# EAGLE design lin_usb_probe (EAGLE 6.5.0)
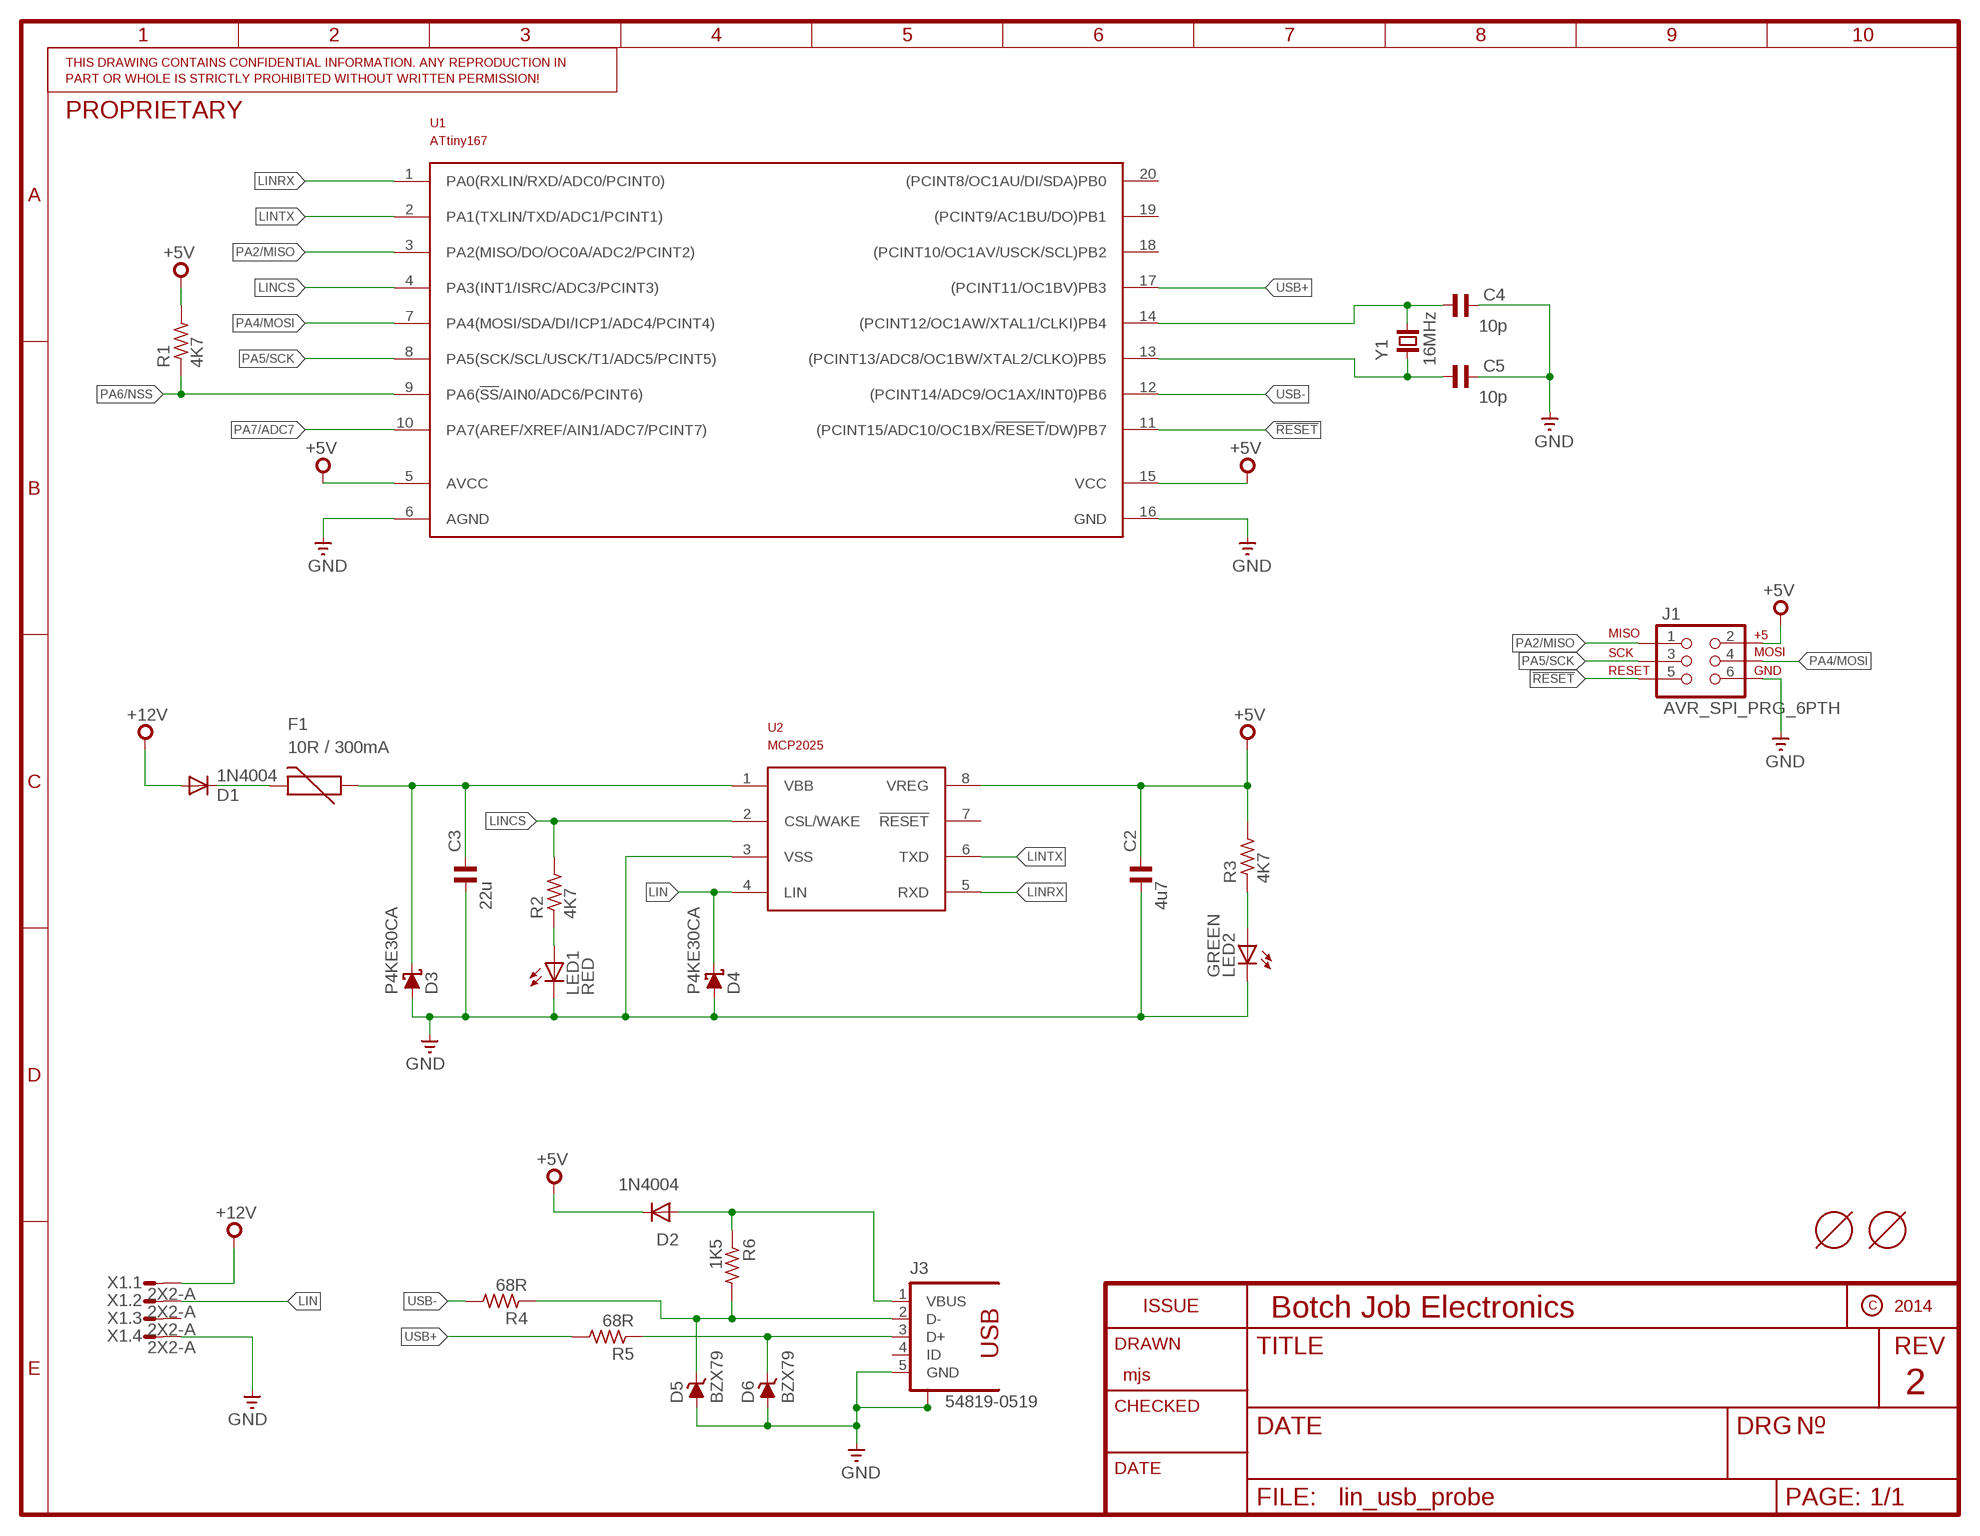
[diagram p0: schematic, sheet 1]
FRAME1 (US_8,5X11): COMPANY: Botch Job Electronics; DRAWN: mjs; REV: 2

## Parts
C2  4u7  C-EU050-024X044  [C050-024X044]
C3  22u  C-EU050-024X044  [C050-024X044]
C4  10p  C-EU025-024X044  [C025-024X044]
C5  10p  C-EU025-024X044  [C025-024X044]
D1  1N4004  [DO41-10]
D2  1N4004  [DO41-10]
D3  P4KE30CA  SCHOTTKY-DIODEDO41-10  [DO41-10]
D4  P4KE30CA  SCHOTTKY-DIODEDO41-10  [DO41-10]
D5  BZX79  [DO35Z10]
D6  BZX79  [DO35Z10]
F1  10R / 300mA  PTCPTH  [PTC]
J1  AVR_SPI_PRG_6PTH  [2X3]
J3  54819-0519  [54819-0519]
LED1  RED  LED3MM  [LED3MM]
LED2  GREEN  LED3MM  [LED3MM]
R1  4K7  R-EU_0207/10  [0207/10]
R2  4K7  R-EU_0207/10  [0207/10]
R3  4K7  R-EU_0207/10  [0207/10]
R4  68R  R-EU_0207/10  [0207/10]
R5  68R  R-EU_0207/10  [0207/10]
R6  1K5  R-EU_0207/10  [0207/10]
U1  ATtiny167  ATTINY16720X  [TSSOP20]
U2  MCP2025  [SO08]
U$1  MOUNT-HOLE3.1MM  [MOUNT-HOLE3.1]
U$2  MOUNT-HOLE3.1MM  [MOUNT-HOLE3.1]
X1  2X2-A  [3-794618-4]
Y1  16MHz  CRYTALHC49S  [HC49/S]

## Nets
!RESET: J1.5 U1.11((PCINT15/ADC10/OC1BX/!RESET!/DW)PB7)
+5V [power]: C2.1 D2.C J1.2 R1.2 R3.2 U1.5(AVCC) U1.15(VCC) U2.8(VREG)
+12V [power]: D1.A X1.1
GND [power]: C2.2 C3.2 C4.1 C5.1 D3.A D4.A D5.A D6.A J1.6 J3.5(GND) J3.S1 J3.S2 LED1.K(C) LED2.K(C) U1.6(AGND) U1.16(GND) U2.3(VSS) X1.4
LIN: D4.C U2.4(LIN) X1.2
LINCS: R2.2 U1.4(PA3(INT1/ISRC/ADC3/PCINT3)) U2.2(CSL/WAKE)
LINRX: U1.1(PA0(RXLIN/RXD/ADC0/PCINT0)) U2.5(RXD)
LINTX: U1.2(PA1(TXLIN/TXD/ADC1/PCINT1)) U2.6(TXD)
N$1: C4.2 U1.14((PCINT12/OC1AW/XTAL1/CLKI)PB4) Y1.2
N$2 [power]: C3.1 D3.C F1.P$1 U2.1(VBB)
N$3: LED1.A R2.1
N$4: LED2.A R3.1
N$5 [power]: D1.C F1.P$2
N$6: D6.C J3.3(D+) R5.1
N$7: D5.C J3.2(D-) R4.1 R6.2
N$8 [power]: D2.A J3.1(VBUS) R6.1
N$9: C5.2 U1.13((PCINT13/ADC8/OC1BW/XTAL2/CLKO)PB5) Y1.1
PA2/MISO: J1.1 U1.3(PA2(MISO/DO/OC0A/ADC2/PCINT2))
PA4/MOSI: J1.4 U1.7(PA4(MOSI/SDA/DI/ICP1/ADC4/PCINT4))
PA5/SCK: J1.3 U1.8(PA5(SCK/SCL/USCK/T1/ADC5/PCINT5))
PA6/NSS: R1.1 U1.9(PA6(!SS!/AIN0/ADC6/PCINT6))
PA7/ADC7: U1.10(PA7(AREF/XREF/AIN1/ADC7/PCINT7))
USB+: R5.2 U1.17((PCINT11/OC1BV)PB3)
USB-: R4.2 U1.12((PCINT14/ADC9/OC1AX/INT0)PB6)
Unconnected: J3.4(ID) U1.18((PCINT10/OC1AV/USCK/SCL)PB2) U1.19((PCINT9/AC1BU/DO)PB1) U1.20((PCINT8/OC1AU/DI/SDA)PB0) U2.7(!RESET) X1.3

## Library data of the parts
C2 = custom:C-EU: CAPACITOR, European symbol; PARTNO: GRM21BR71A475KA73K
C3 = custom:C-EU: CAPACITOR, European symbol; PARTNO: C2012X5R1V226M125AC
C4 C5 = custom:C-EU: CAPACITOR, European symbol
D1 = custom:1N4004: DIODE general purpose rectifier, 1 A; PARTNO: 1N4004-TP
D2 = custom:1N4004: DIODE general purpose rectifier, 1 A
D3 D4 = custom:SCHOTTKY-DIODE: Schottky Diode; PARTNO: P4KE30CA
D5 D6 = custom:BZX79: Z DIODE
F1 = custom:PTC: Resettable Fuse PTC Resettable Fuse. Spark Fun Electronics SKU : COM-08357; PARTNO: 600R150-RBZR
J1 = custom:AVR_SPI_PRG_6: AVR ISP 6 Pin This is the reduced ISP connector for AVR programming. Common on Arduino. This footprint will take up less PCB space and can be used with a 10-pin to 6-pin adapter such as SKU: BOB-08508
J3 = custom:54819-0519: USB - OTG, miniUSB Type B, Molex
LED1 = custom:LED: LEDs Standard schematic elements and footprints for 5mm, 3mm, 1206, and 0603 sized LEDs. 5mm - Spark Fun Electronics SKU : COM-00529 (and others); PARTNO: C4SMF-RJS-CT0W0BB2
LED2 = custom:LED: LEDs Standard schematic elements and footprints for 5mm, 3mm, 1206, and 0603 sized LEDs. 5mm - Spark Fun Electronics SKU : COM-00529 (and others); PARTNO: C4SMF-GJS-CV0Y0792
R1-R6 = custom:R-EU_: RESISTOR, European symbol; PARTNO: ERJ-6GEYJ472V
U1 = custom:ATTINY167; PARTNO: ATTINY167-A15XZ
U2 = custom:MCP2025: LIN Transceiver with Voltage Regulator; PARTNO: MCP2025-500E/SN
U$1 U$2 = custom:MOUNT-HOLE
X1 = custom:2X2
Y1 = custom:CRYTAL: CRYSTAL

## Net classes
0 default: width 0.305 mm
1 power: width 0.406 mm

## Board
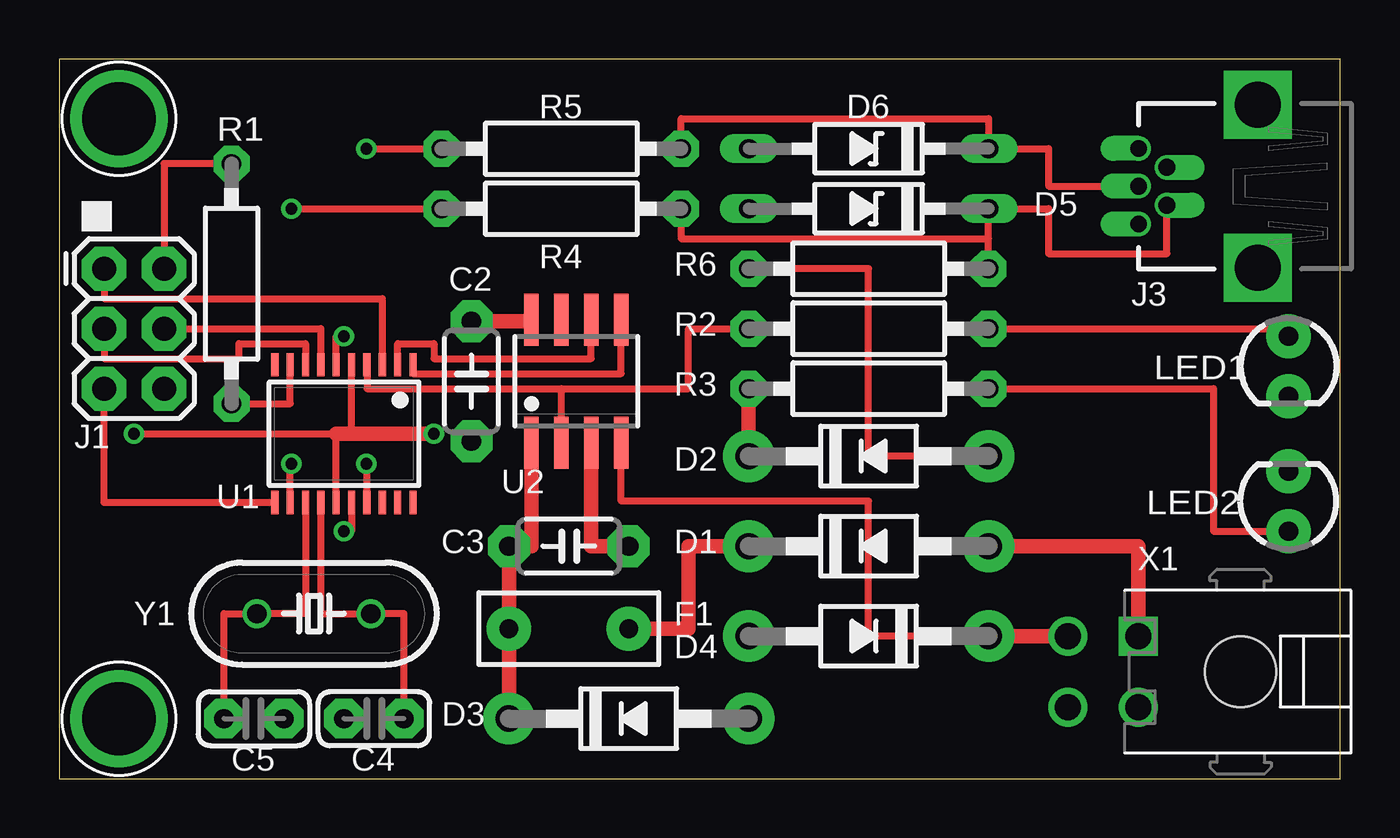
[diagram p1: board, top side]
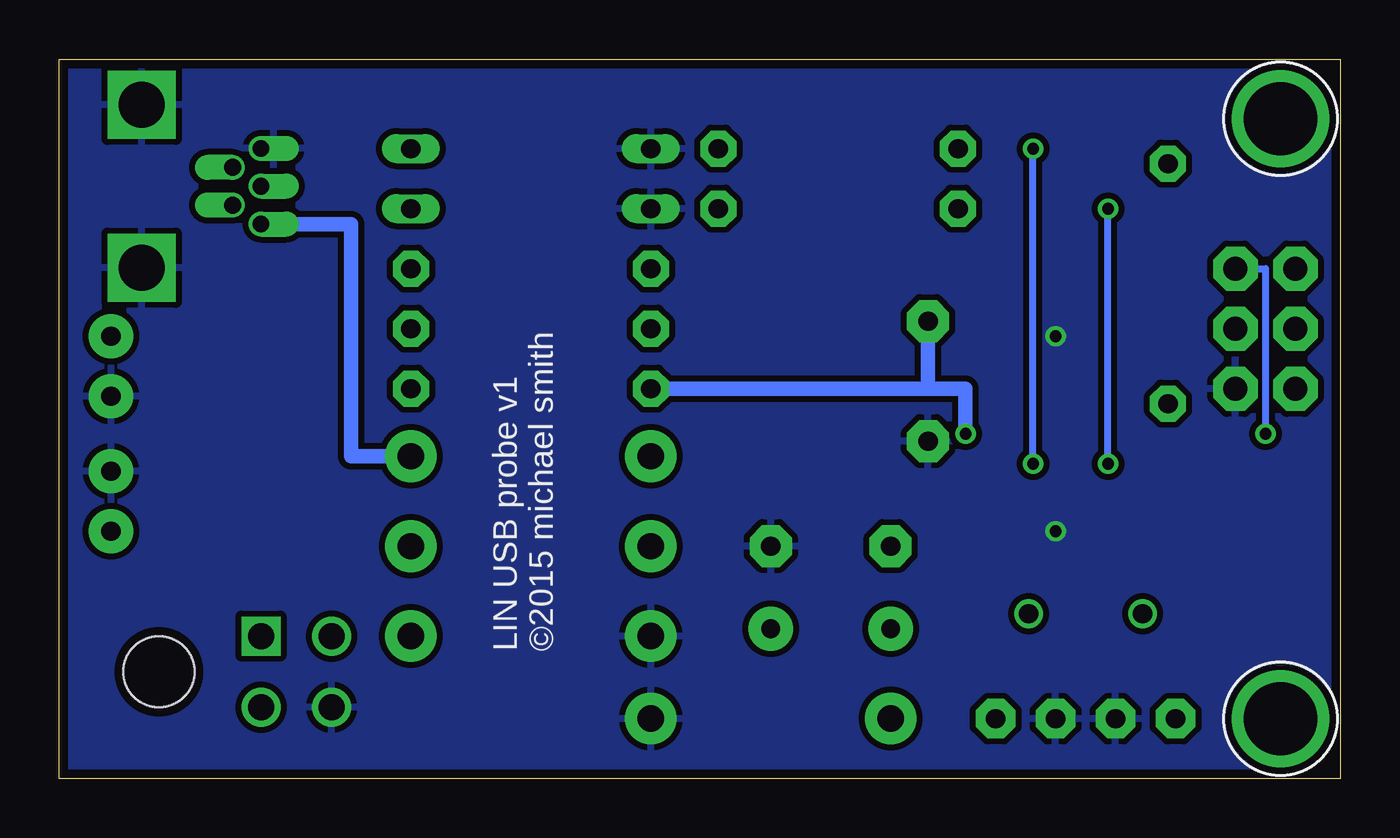
[diagram p2: board, bottom side, seen from below]

Size 54.27 x 30.47 mm. Coordinates in mm from the lower left corner, seen from the top.
Outline: 0,0 54.27,0 54.27,30.47 0,30.47 0,0
Copper layers (1*16): Top 0.0356mm / dielectric 1.5011mm / Bottom 0.0356mm
Design rules "LaenPCBOrder": minimum track width 6mil, minimum drill 13mil, track to track 6mil, track to pad 6mil, pad to pad 6mil, via to via 6mil, smd to smd 6mil, copper to edge 15mil, drill to drill 6mil, minimum pad ring 7mil, minimum via ring 7mil, stop-mask expansion 3mil, vias tented up to drill 0mil, thermal gap 10mil

### Footprints (pad centres in the part's own frame; a part is rotated, then mirrored left to right if it is on the bottom)
C050-024X044 = drill 0.813 pad 1.778 octagon: 1 -2.54,0; 2 2.54,0
C025-024X044 = drill 0.813 pad 1.676 octagon: 1 -1.27,0; 2 1.27,0
DO41-10 = drill 1.118 pad 2.184: A 5.08,0; C -5.08,0
DO35Z10 = drill 0.813 long: A 5.08,0; C -5.08,0
PTC = drill 0.8 pad 1.88: P$1 -2.54,0; P$2 2.54,0
2X3 = drill 1.016 pad 1.88 octagon: 1 0,0; 2 0,2.54; 3 2.54,0; 4 2.54,2.54; 5 5.08,0; 6 5.08,2.54
54819-0519 = drill 0.711 offset: 1 1.6,0; 2 0.8,1.2; 3 0,0; 4 -0.8,1.2; 5 -1.6,0 | drill 1.93 square: S1 -3.45,5.05; S2 3.45,5.05
LED3MM = drill 0.813 pad 1.88: A -1.27,0; K 1.27,0
0207/10 = drill 0.813 pad 1.524 octagon: 1 -5.08,0; 2 5.08,0
TSSOP20 = smd 0.305 x 0.991: 1 -2.925,-2.918; 2 -2.275,-2.918; 3 -1.625,-2.918; 4 -0.975,-2.918; 5 -0.325,-2.918; 6 0.325,-2.918; 7 0.975,-2.918; 8 1.625,-2.918; 9 2.275,-2.918; 10 2.925,-2.918; 11 2.925,2.918; 12 2.275,2.918; 13 1.625,2.918; 14 0.975,2.918; 15 0.325,2.918; 16 -0.325,2.918; 17 -0.975,2.918; 18 -1.625,2.918; 19 -2.275,2.918; 20 -2.925,2.918
SO08 = smd 0.6 x 2.2: 1 -1.905,-2.6; 2 -0.635,-2.6; 3 0.635,-2.6; 4 1.905,-2.6; 5 1.905,2.6; 6 0.635,2.6; 7 -0.635,2.6; 8 -1.905,2.6
MOUNT-HOLE3.1 = drill 3.1 pad 4.1: P$1 0,0
3-794618-4 = drill 1.1 square: 1 0,0 | drill 1.1: 2 0,3; 3 -3,0; 4 -3,3 | hole 3: -1.5,-4.32
HC49/S = drill 0.813: 1 -2.413,0; 2 2.413,0

### Placement (x,y rotation side)
C2  17.46,16.83 270 top
C3  21.59,9.84 0 top
C4  13.34,2.54 0 top
C5  8.26,2.54 180 top
D1  34.29,9.84 0 top
D2  34.29,13.65 0 top
D3  24.13,2.54 0 top
D4  34.29,6.03 180 top
D5  34.29,24.13 180 top
D6  34.29,26.67 180 top
F1  21.59,6.35 0 top
J1  1.91,21.59 270 top
J3  45.72,25.08 270 top
LED1  52.07,17.46 270 top
LED2  52.07,11.75 90 top
R1  7.3,20.95 90 top
R2  34.29,19.05 180 top
R3  34.29,16.51 180 top
R4  21.27,24.13 180 top
R5  21.27,26.67 180 top
R6  34.29,21.59 0 top
U1  12.06,14.61 180 top
U2  21.91,16.83 0 top
U$1  2.54,2.54 0 top
U$2  2.54,27.94 0 top
X1  45.72,6.03 90 top
Y1  10.79,6.99 0 top

### Tracks (layer width: path | path; a pad name or v marks a point on that pad's centre or on a via)
!RESET
  Top 0.305: U1.11 1.91,11.69 J1.5
+5V  (via drill 0.5)
  Top 0.305: U1.15 11.74,14.61 v3.17,14.61 | 12.39,14.61 U1.5 | R1.2 4.45,26.04 J1.2
  Top 0.61: C2.1 20,19.37 U2.8 | 11.74,14.61 12.06,14.61 12.39,14.61 v15.88,14.61 | R3.2 D2.C
  Bottom 0.305: J1.2 3.17,21.59 v3.17,14.61
  Bottom 0.61: R3.2 17.46,16.51 | 17.46,16.51 C2.1 | v15.88,14.61 15.88,16.51 17.46,16.51
+12V
  Top 0.61: X1.1 45.72,9.84 D1.A
GND  (via drill 0.5)
  Top 0.305: U1.16 12.39,10.48 v12.06,10.48 | U1.6 11.74,18.73 v12.06,18.73
  Top 0.61: C3.2 22.54,9.84 U2.3
  pour Bottom (isolate 0.254): 0,0 53.98,0 53.98,30.48 0,30.48
LIN
  Top 0.305: D4.C 34.29,6.03 34.29,11.75 23.81,11.75 U2.4
  Top 0.61: D4.C X1.2
LINCS
  Top 0.305: U1.4 13.04,16.51 21.27,16.51 | 21.27,16.51 U2.2 | 21.27,16.51 26.67,16.51 26.67,19.05 R2.2
LINRX
  Top 0.305: U1.1 14.99,17.14 23.81,17.14 U2.5
LINTX
  Top 0.305: U1.2 14.34,18.41 15.88,18.41 15.88,17.78 22.54,17.78 U2.6
N$1
  Top 0.305: C4.2 14.61,6.99 Y1.2 11.09,6.99 U1.14
N$2
  Top 0.61: D3.C F1.P$1 C3.1 20,9.84 U2.1
N$3
  Top 0.305: R2.1 52.07,19.05 LED1.A
N$4
  Top 0.305: R3.1 48.9,16.51 48.9,10.48 LED2.A
N$5
  Top 0.61: D1.C 26.67,9.84 26.67,6.35 F1.P$2
N$6
  Top 0.305: R5.1 26.35,27.94 39.37,27.94 D6.C 41.91,26.67 41.91,25.08 J3.3
N$7
  Top 0.305: J3.2 46.92,22.23 41.91,22.23 41.91,24.13 D5.C 39.37,22.86 | R6.2 39.37,22.86 | R4.1 26.35,22.86 39.37,22.86
N$8
  Top 0.305: D2.A 34.29,13.65 34.29,21.59 R6.1
  Bottom 0.61: J3.1 41.91,23.48 41.91,13.65 D2.A
N$9
  Top 0.305: C5.2 6.99,6.99 Y1.1 10.44,6.99 U1.13
PA2/MISO
  Top 0.305: J1.1 1.91,20.32 13.69,20.32 U1.3
PA4/MOSI
  Top 0.305: J1.4 11.09,19.05 U1.7
PA5/SCK
  Top 0.305: J1.3 1.91,17.78 7.62,17.78 7.62,18.41 10.44,18.41 U1.8
PA6/NSS
  Top 0.305: R1.1 9.79,15.88 U1.9
USB+  (via drill 0.5)
  Top 0.305: U1.17 13.04,13.34 v13.02,13.34 | v13.02,26.67 R5.2
  Bottom 0.305: v13.02,13.34 v13.02,26.67
USB-  (via drill 0.5)
  Top 0.305: U1.12 9.79,13.34 v9.84,13.34 | v9.84,24.13 R4.2
  Bottom 0.305: v9.84,13.34 v9.84,24.13

### Text on the board
bNames: LIN USB probe v1 / ©2015 michael smith